# Altium schematic sheet EMI Stage Break Out.SchDoc
size A4
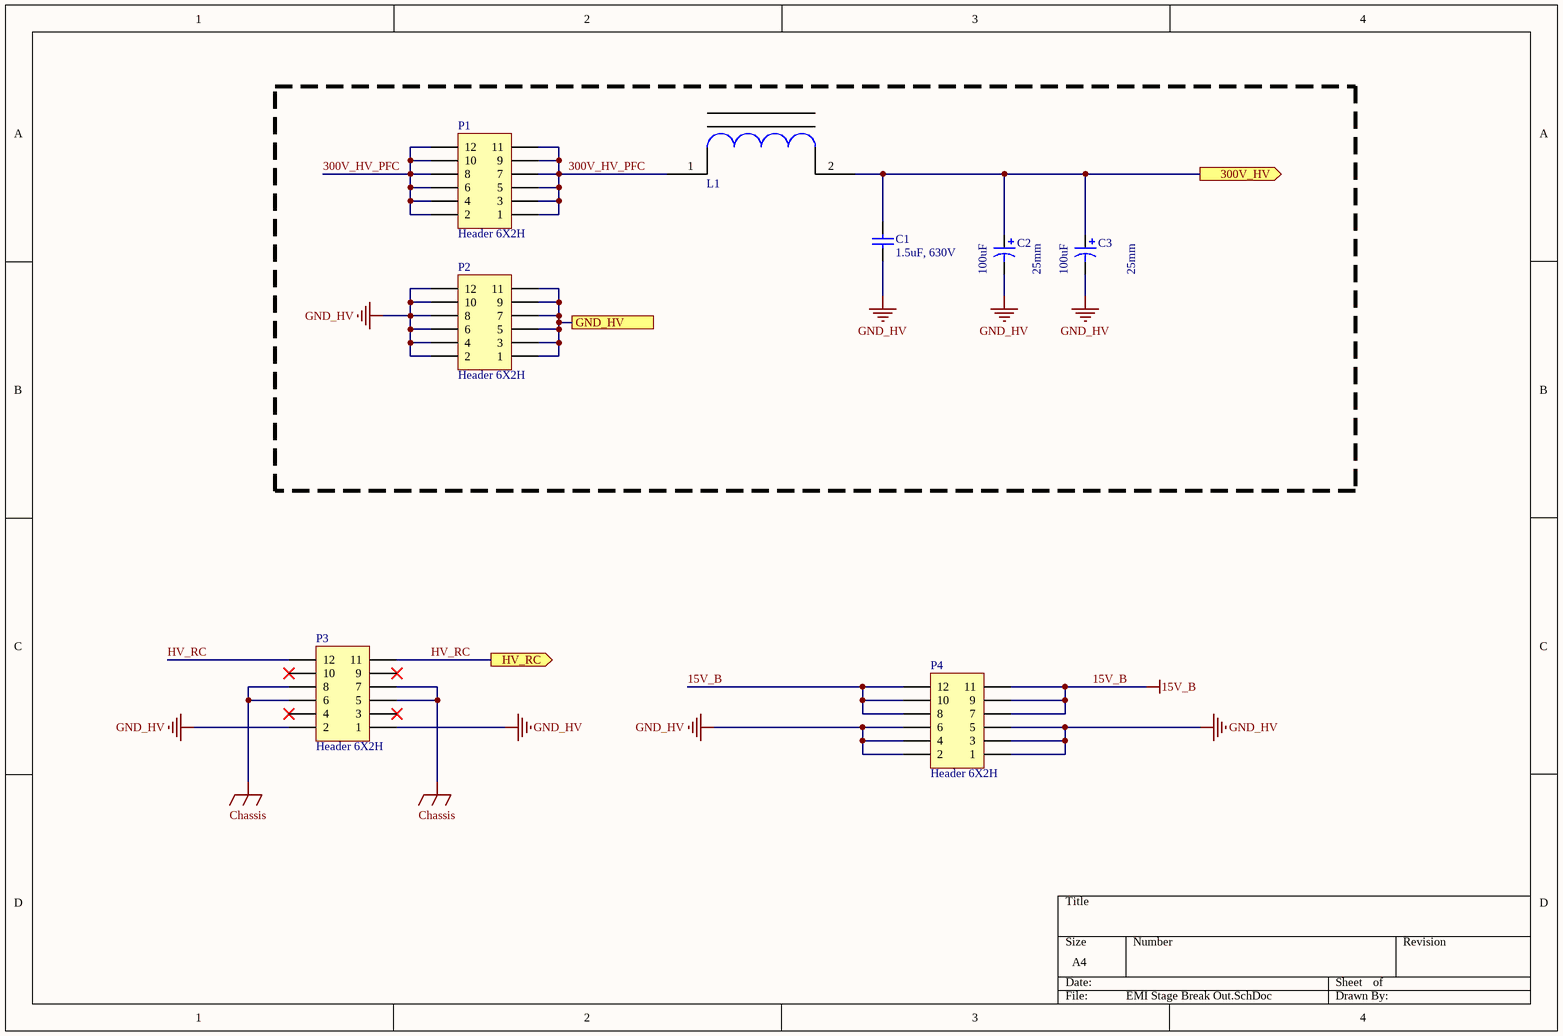
[diagram p0: EMI Stage Break Out.SchDoc]

## Parts
C1  1.5uF, 630V  [L31_W15_H24.5_P27.5]
C2  25mm  value 100uF  [450V_25mm_Dia_10mm_pitch - Black]
C3  25mm  value 100uF  [450V_25mm_Dia_10mm_pitch - Black]
L1  Transformer_Inductor  [Shim Inductor]  (value not drawn)
P1  Header 6X2H  [Stackable-Conn]
P2  Header 6X2H  [Stackable-Conn]
P3  Header 6X2H  [Stackable-Conn]
P4  Header 6X2H  [Stackable-Conn]

## Ports
300V_HV (out), GND_HV, HV_RC (out)

## Nets
15V_B: P4.7 P4.8 P4.9 P4.10 P4.11 P4.12
Chassis: P3.5 P3.6 P3.7 P3.8
GND_HV: C1.1 C2.2 C3.2 P2.2 P2.4 P2.6 P2.8 P2.10 P2.12 P3.1 P3.2 P4.1 P4.2 P4.3 P4.4 P4.5 P4.6
300V_HV: C1.2 C2.1 C3.1 L1.2 ; port 300V_HV
300V_HV_PFC: L1.1 P1.1 P1.2 P1.3 P1.4 P1.5 P1.6 P1.7 P1.8 P1.9 P1.10 P1.11 P1.12
GND_HV: P2.1 P2.3 P2.5 P2.7 P2.9 P2.11 ; port GND_HV  [a separate net that carries the same name]
HV_RC: P3.11 P3.12 ; port HV_RC

Not connected (* = marked no-connect by the designer): P3 3* 4* 9* 10*

## Library data of the parts
C1 = 890303427009CS: WCAP-FTBE THT Film Capacitors, 1.5uF, 630VDC; Insulation Resistance: 3000Ohm x F; Dissipation Factor@100kHz: 5.2%; Dissipation Factor@1kHz: 1%; Dissipation Factor@10kHz: 1.6%; Pitch: 27.5mm; Rate of Voltage Rise: 17V/us; Technical Reference: MPSP275155K630DCPP25004; ComponentLink1Description: Manufacturer; ComponentLink1URL: http://www.we-online.de; ComponentLink2Description: Datasheet; ComponentLink2URL: https://katalog.we-online.com/pbs/datasheet/890303427009CS.pdf; Length: 31mm; Mounting Technology: THT; Packaging: Carton; Part Number: 890303427009CS; Operating Temperature: -40 to +85degC; Width: 15mm; Capacitance: 1.5uF; Height: 24.5mm; Rated Voltage: 630VDC; Publisher: Wurth Elektronik; Published Date: August 2019
C2 C3 = Cap Pol1: Polarized Capacitor (Radial); Published: 8-Jun-2000; LatestRevisionDate: 17-Jul-2002; LatestRevisionNote: Re-released for DXP Platform.; PackageReference: RB7.6-15; Publisher: Altium Limited; PackageDescription: Polarized Capacitor (Radial); 2 Leads
P1-P4 = Header 6X2H: Header, 6-Pin, Dual row, Right Angle; LatestRevisionDate: 17-Jul-2002; LatestRevisionNote: Re-released for DXP Platform.; Publisher: Altium Limited